# EAGLE schematic Eddy Backplane (EAGLE 9.5.2)

## Sheet 1 of 3: Back Plane
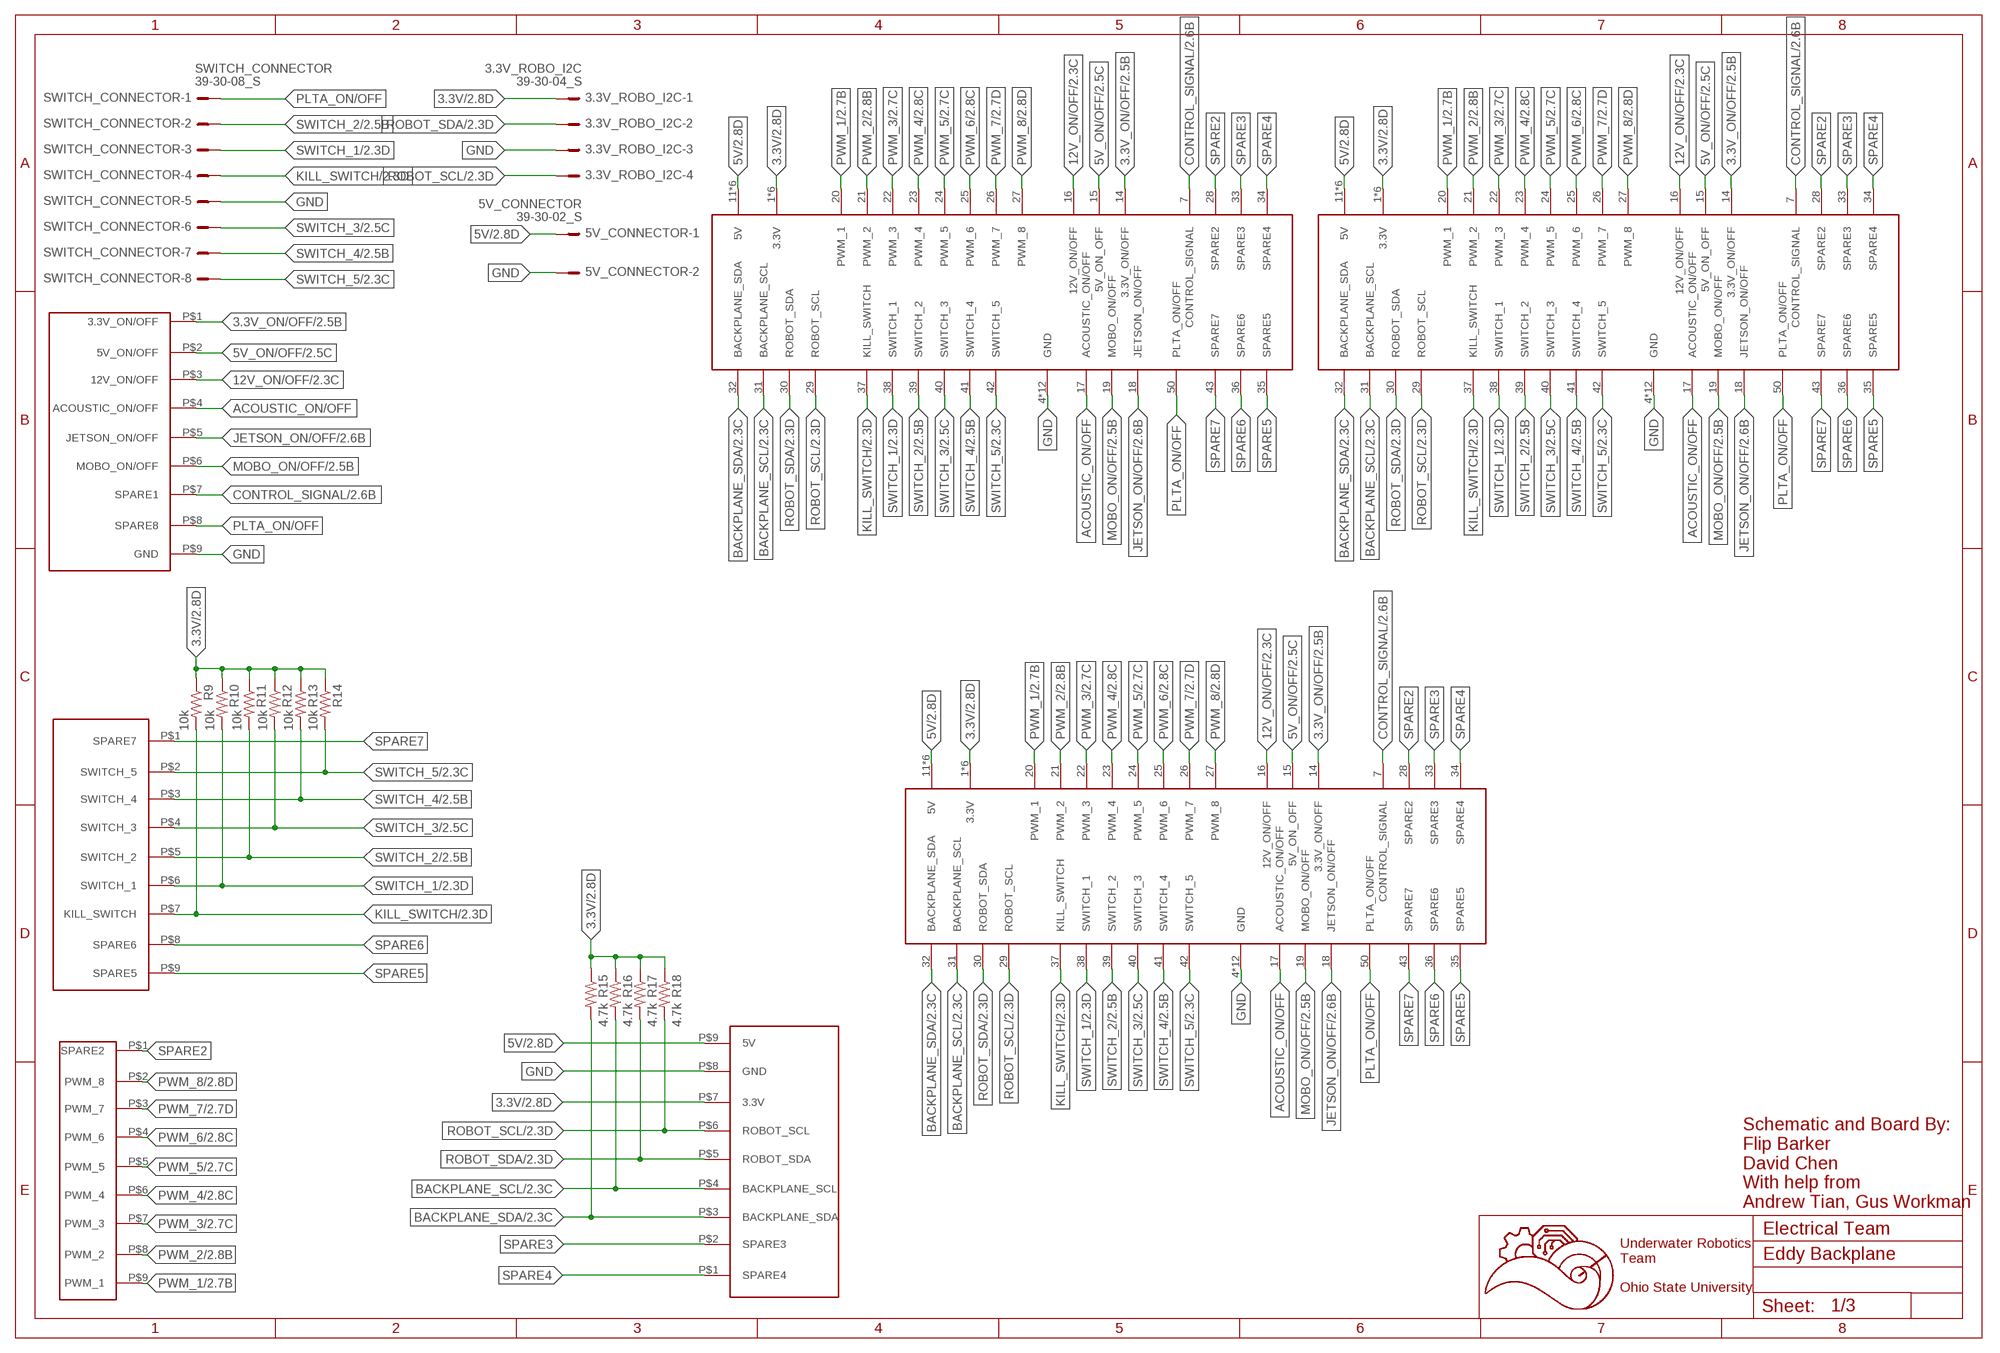
[diagram p0: schematic, sheet 1]

### Parts
3.3V_ROBO_I2C  39-30-04_S  [39-30-?04?]
5V_CONNECTOR  39-30-02_S  [39-30-?02?]
PWR_ON  929870-01-09_3  [929852-01-09_1ROW]
R9  10k  R-US_R0603  [R0603]
R10  10k  R-US_R0603  [R0603]
R11  10k  R-US_R0603  [R0603]
R12  10k  R-US_R0603  [R0603]
R13  10k  R-US_R0603  [R0603]
R14  10k  R-US_R0603  [R0603]
R15  4.7k  R-US_R0603  [R0603]
R16  4.7k  R-US_R0603  [R0603]
R17  4.7k  R-US_R0603  [R0603]
R18  4.7k  R-US_R0603  [R0603]
SWITCH_CONN  929870-01-09_1  [929852-01-09_1ROW]
SWITCH_CONNECTOR  39-30-08_S  [39-30-?08?]
U$1  5530843-FEMALE  [5530843-6-BACKPLANEMATE]
U$2  5530843-FEMALE  [5530843-6-BACKPLANEMATE]
U$3  5530843-FEMALE  [5530843-6-BACKPLANEMATE]
U$6  929870-01-09_2  [929852-01-09_1ROW]
U$8  929870-01-09_4  [929852-01-09_1ROW]

### Nets
3.3V: 3.3V_ROBO_I2C.1 R9.1 R10.1 R11.1 R12.1 R13.1 R14.1 R15.1 R16.1 R17.1 R18.1 U$1.1(3.3V) U$1.2(3.3V) U$1.3(3.3V) U$1.54(3.3V) U$1.55(3.3V) U$1.56(3.3V) U$2.1(3.3V) U$2.2(3.3V) U$2.3(3.3V) U$2.54(3.3V) U$2.55(3.3V) U$2.56(3.3V) U$3.1(3.3V) U$3.2(3.3V) U$3.3(3.3V) U$3.54(3.3V) U$3.55(3.3V) U$3.56(3.3V) U$8.P$7(3.3V) ; also sheet 2,3
3.3V_ON/OFF: PWR_ON.P$1(3.3V_ON/OFF) U$1.14(3.3V_ON/OFF) U$2.14(3.3V_ON/OFF) U$3.14(3.3V_ON/OFF) ; also sheet 2
5V: 5V_CONNECTOR.1 U$1.11(5V) U$1.12(5V) U$1.13(5V) U$1.44(5V) U$1.45(5V) U$1.46(5V) U$2.11(5V) U$2.12(5V) U$2.13(5V) U$2.44(5V) U$2.45(5V) U$2.46(5V) U$3.11(5V) U$3.12(5V) U$3.13(5V) U$3.44(5V) U$3.45(5V) U$3.46(5V) U$8.P$9(5V) ; also sheet 2
5V_ON/OFF: PWR_ON.P$2(5V_ON/OFF) U$1.15(5V_ON_OFF) U$2.15(5V_ON_OFF) U$3.15(5V_ON_OFF) ; also sheet 2
12V_ON/OFF: PWR_ON.P$3(12V_ON/OFF) U$1.16(12V_ON/OFF) U$2.16(12V_ON/OFF) U$3.16(12V_ON/OFF) ; also sheet 2
ACOUSTIC_ON/OFF: PWR_ON.P$4(ACOUSTIC_ON/OFF) U$1.17(ACOUSTIC_ON/OFF) U$2.17(ACOUSTIC_ON/OFF) U$3.17(ACOUSTIC_ON/OFF)
BACKPLANE_SCL: R16.2 U$1.31(BACKPLANE_SCL) U$2.31(BACKPLANE_SCL) U$3.31(BACKPLANE_SCL) U$8.P$4(BACKPLANE_SCL) ; also sheet 2
BACKPLANE_SDA: R15.2 U$1.32(BACKPLANE_SDA) U$2.32(BACKPLANE_SDA) U$3.32(BACKPLANE_SDA) U$8.P$3(BACKPLANE_SDA) ; also sheet 2
CONTROL_SIGNAL: PWR_ON.P$7(SPARE1) U$1.7(CONTROL_SIGNAL) U$2.7(CONTROL_SIGNAL) U$3.7(CONTROL_SIGNAL) ; also sheet 2
GND: 3.3V_ROBO_I2C.3 5V_CONNECTOR.2 PWR_ON.P$9(GND) SWITCH_CONNECTOR.5 U$1.4(GND) U$1.5(GND) U$1.6(GND) U$1.8(GND) U$1.9(GND) U$1.10(GND) U$1.47(GND) U$1.48(GND) U$1.49(GND) U$1.51(GND) U$1.52(GND) U$1.53(GND) U$2.4(GND) U$2.5(GND) U$2.6(GND) U$2.8(GND) U$2.9(GND) U$2.10(GND) U$2.47(GND) U$2.48(GND) U$2.49(GND) U$2.51(GND) U$2.52(GND) U$2.53(GND) U$3.4(GND) U$3.5(GND) U$3.6(GND) U$3.8(GND) U$3.9(GND) U$3.10(GND) U$3.47(GND) U$3.48(GND) U$3.49(GND) U$3.51(GND) U$3.52(GND) U$3.53(GND) U$8.P$8(GND) ; also sheet 2,3
JETSON_ON/OFF: PWR_ON.P$5(JETSON_ON/OFF) U$1.18(JETSON_ON/OFF) U$2.18(JETSON_ON/OFF) U$3.18(JETSON_ON/OFF) ; also sheet 2
KILL_SWITCH: R9.2 SWITCH_CONN.P$7(KILL_SWITCH) SWITCH_CONNECTOR.4 U$1.37(KILL_SWITCH) U$2.37(KILL_SWITCH) U$3.37(KILL_SWITCH) ; also sheet 2
MOBO_ON/OFF: PWR_ON.P$6(MOBO_ON/OFF) U$1.19(MOBO_ON/OFF) U$2.19(MOBO_ON/OFF) U$3.19(MOBO_ON/OFF) ; also sheet 2
PLTA_ON/OFF: PWR_ON.P$8(SPARE8) SWITCH_CONNECTOR.1 U$1.50(PLTA_ON/OFF) U$2.50(PLTA_ON/OFF) U$3.50(PLTA_ON/OFF)
PWM_1: U$1.20(PWM_1) U$2.20(PWM_1) U$3.20(PWM_1) U$6.P$9(PWM_1) ; also sheet 2
PWM_2: U$1.21(PWM_2) U$2.21(PWM_2) U$3.21(PWM_2) U$6.P$8(PWM_2) ; also sheet 2
PWM_3: U$1.22(PWM_3) U$2.22(PWM_3) U$3.22(PWM_3) U$6.P$7(PWM_3) ; also sheet 2
PWM_4: U$1.23(PWM_4) U$2.23(PWM_4) U$3.23(PWM_4) U$6.P$6(PWM_4) ; also sheet 2
PWM_5: U$1.24(PWM_5) U$2.24(PWM_5) U$3.24(PWM_5) U$6.P$5(PWM_5) ; also sheet 2
PWM_6: U$1.25(PWM_6) U$2.25(PWM_6) U$3.25(PWM_6) U$6.P$4(PWM_6) ; also sheet 2
PWM_7: U$1.26(PWM_7) U$2.26(PWM_7) U$3.26(PWM_7) U$6.P$3(PWM_7) ; also sheet 2
PWM_8: U$1.27(PWM_8) U$2.27(PWM_8) U$3.27(PWM_8) U$6.P$2(PWM_8) ; also sheet 2
ROBOT_SCL: 3.3V_ROBO_I2C.4 R18.2 U$1.29(ROBOT_SCL) U$2.29(ROBOT_SCL) U$3.29(ROBOT_SCL) U$8.P$6(ROBOT_SCL) ; also sheet 2
ROBOT_SDA: 3.3V_ROBO_I2C.2 R17.2 U$1.30(ROBOT_SDA) U$2.30(ROBOT_SDA) U$3.30(ROBOT_SDA) U$8.P$5(ROBOT_SDA) ; also sheet 2
SPARE2: U$1.28(SPARE2) U$2.28(SPARE2) U$3.28(SPARE2) U$6.P$1(SPARE2)
SPARE3: U$1.33(SPARE3) U$2.33(SPARE3) U$3.33(SPARE3) U$8.P$2(SPARE3)
SPARE4: U$1.34(SPARE4) U$2.34(SPARE4) U$3.34(SPARE4) U$8.P$1(SPARE4)
SPARE5: SWITCH_CONN.P$9(SPARE5) U$1.35(SPARE5) U$2.35(SPARE5) U$3.35(SPARE5)
SPARE6: SWITCH_CONN.P$8(SPARE6) U$1.36(SPARE6) U$2.36(SPARE6) U$3.36(SPARE6)
SPARE7: SWITCH_CONN.P$1(SPARE7) U$1.43(SPARE7) U$2.43(SPARE7) U$3.43(SPARE7)
SWITCH_1: R10.2 SWITCH_CONN.P$6(SWITCH_1) SWITCH_CONNECTOR.3 U$1.38(SWITCH_1) U$2.38(SWITCH_1) U$3.38(SWITCH_1) ; also sheet 2
SWITCH_2: R11.2 SWITCH_CONN.P$5(SWITCH_2) SWITCH_CONNECTOR.2 U$1.39(SWITCH_2) U$2.39(SWITCH_2) U$3.39(SWITCH_2) ; also sheet 2
SWITCH_3: R12.2 SWITCH_CONN.P$4(SWITCH_3) SWITCH_CONNECTOR.6 U$1.40(SWITCH_3) U$2.40(SWITCH_3) U$3.40(SWITCH_3) ; also sheet 2
SWITCH_4: R13.2 SWITCH_CONN.P$3(SWITCH_4) SWITCH_CONNECTOR.7 U$1.41(SWITCH_4) U$2.41(SWITCH_4) U$3.41(SWITCH_4) ; also sheet 2
SWITCH_5: R14.2 SWITCH_CONN.P$2(SWITCH_5) SWITCH_CONNECTOR.8 U$1.42(SWITCH_5) U$2.42(SWITCH_5) U$3.42(SWITCH_5) ; also sheet 2

### Notes on the sheet
- Schematic and Board By:
  Flip Barker
  David Chen
  With help from 
  Andrew Tian, Gus Workman
- Electrical Team
- Underwater Robotics
  Team
  
  Ohio State University

## Sheet 2 of 3: Microcontroller
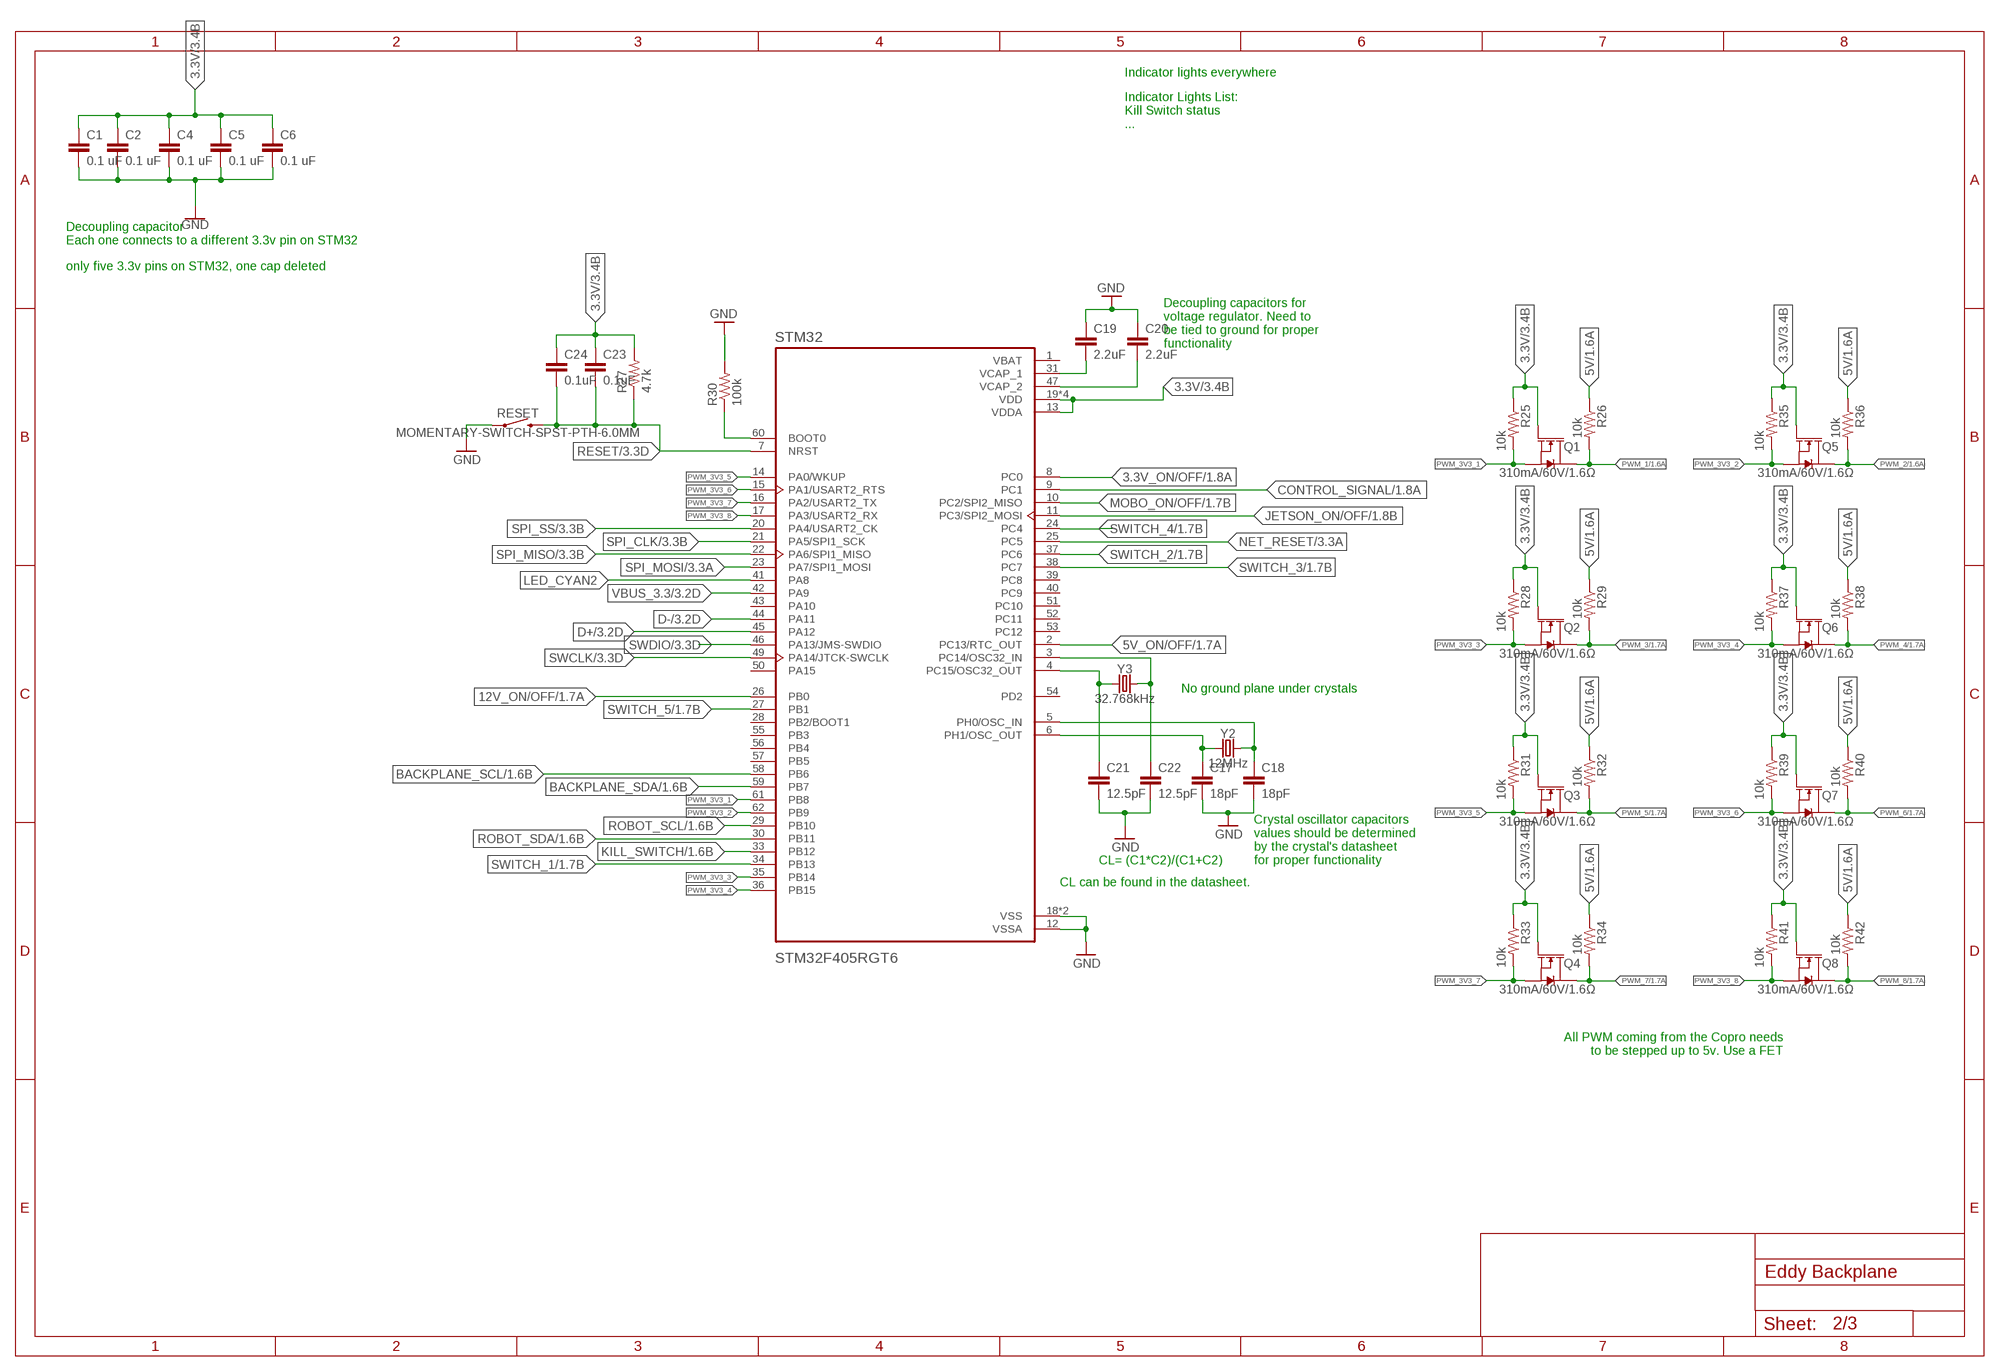
[diagram p1: schematic, sheet 2]

### Parts
C1  0.1 uF  C-EUC0603  [C0603]
C2  0.1 uF  C-EUC0603  [C0603]
C4  0.1 uF  C-EUC0603  [C0603]
C5  0.1 uF  C-EUC0603  [C0603]
C6  0.1 uF  C-EUC0603  [C0603]
C17  18pF  C-EUC0603  [C0603]
C18  18pF  C-EUC0603  [C0603]
C19  2.2uF  C-EUC0603  [C0603]
C20  2.2uF  C-EUC0603  [C0603]
C21  12.5pF  C-EUC0603  [C0603]
C22  12.5pF  C-EUC0603  [C0603]
C23  0.1uF  C-EUC0603  [C0603]
C24  0.1uF  C-EUC0603  [C0603]
Q1  310mA/60V/1.6Ω  MOSFET-NCH-2N7002PW  [SOT323]
Q2  310mA/60V/1.6Ω  MOSFET-NCH-2N7002PW  [SOT323]
Q3  310mA/60V/1.6Ω  MOSFET-NCH-2N7002PW  [SOT323]
Q4  310mA/60V/1.6Ω  MOSFET-NCH-2N7002PW  [SOT323]
Q5  310mA/60V/1.6Ω  MOSFET-NCH-2N7002PW  [SOT323]
Q6  310mA/60V/1.6Ω  MOSFET-NCH-2N7002PW  [SOT323]
Q7  310mA/60V/1.6Ω  MOSFET-NCH-2N7002PW  [SOT323]
Q8  310mA/60V/1.6Ω  MOSFET-NCH-2N7002PW  [SOT323]
R25  10k  R-US_R0603  [R0603]
R26  10k  R-US_R0603  [R0603]
R27  4.7k  R-US_R0603  [R0603]
R28  10k  R-US_R0603  [R0603]
R29  10k  R-US_R0603  [R0603]
R30  100k  R-US_R0603  [R0603]
R31  10k  R-US_R0603  [R0603]
R32  10k  R-US_R0603  [R0603]
R33  10k  R-US_R0603  [R0603]
R34  10k  R-US_R0603  [R0603]
R35  10k  R-US_R0603  [R0603]
R36  10k  R-US_R0603  [R0603]
R37  10k  R-US_R0603  [R0603]
R38  10k  R-US_R0603  [R0603]
R39  10k  R-US_R0603  [R0603]
R40  10k  R-US_R0603  [R0603]
R41  10k  R-US_R0603  [R0603]
R42  10k  R-US_R0603  [R0603]
RESET  MOMENTARY-SWITCH-SPST-PTH-6.0MM  [TACTILE_SWITCH_PTH_6.0MM]
STM32  STM32F405RGT6  [QFP50P1200X1200X160-64N]
Y2  12MHz  CRYSTAL-16MHZPTH-HC49US  [HC49US]
Y3  32.768kHz  CRYSTAL-32.768KHZSMD-3.2X1.5  [CRYSTAL-SMD-3.2X1.5MM]

### Nets
3.3V: C1.1 C2.1 C4.1 C5.1 C6.1 C23.1 C24.1 Q1.1(G) Q2.1(G) Q3.1(G) Q4.1(G) Q5.1(G) Q6.1(G) Q7.1(G) Q8.1(G) R25.1 R27.2 R28.1 R31.1 R33.1 R35.1 R37.1 R39.1 R41.1 STM32.13(VDDA) STM32.19(VDD) STM32.32(VDD) STM32.48(VDD) STM32.64(VDD) ; also sheet 1,3
3.3V_ON/OFF: STM32.8(PC0) ; also sheet 1
5V: R26.1 R29.1 R32.1 R34.1 R36.1 R38.1 R40.1 R42.1 ; also sheet 1
5V_ON/OFF: STM32.2(PC13/RTC_OUT) ; also sheet 1
12V_ON/OFF: STM32.26(PB0) ; also sheet 1
BACKPLANE_SCL: STM32.58(PB6) ; also sheet 1
BACKPLANE_SDA: STM32.59(PB7) ; also sheet 1
CONTROL_SIGNAL: STM32.9(PC1) ; also sheet 1
D+: STM32.45(PA12) ; also sheet 3
D-: STM32.44(PA11) ; also sheet 3
GND: C1.2 C2.2 C4.2 C5.2 C6.2 C17.2 C18.2 C19.1 C20.1 C21.2 C22.2 R30.2 RESET.1 STM32.12(VSSA) STM32.18(VSS) STM32.63(VSS) ; also sheet 1,3
JETSON_ON/OFF: STM32.11(PC3/SPI2_MOSI) ; also sheet 1
KILL_SWITCH: STM32.33(PB12) ; also sheet 1
LED_CYAN2: STM32.41(PA8)
MOBO_ON/OFF: STM32.10(PC2/SPI2_MISO) ; also sheet 1
N$17: C17.1 STM32.6(PH1/OSC_OUT) Y2.1
N$18: C18.1 STM32.5(PH0/OSC_IN) Y2.2
N$19: C20.2 STM32.47(VCAP_2)
N$20: C19.2 STM32.31(VCAP_1)
N$21: C21.1 STM32.4(PC15/OSC32_OUT) Y3.P$1
N$29: C22.1 STM32.3(PC14/OSC32_IN) Y3.P$2
N$30: R30.1 STM32.60(BOOT0)
NET_RESET: STM32.25(PC5) ; also sheet 3
PWM_1: Q1.3(D) R26.2 ; also sheet 1
PWM_2: Q5.3(D) R36.2 ; also sheet 1
PWM_3: Q2.3(D) R29.2 ; also sheet 1
PWM_3V3_1: Q1.2(S) R25.2 STM32.61(PB8)
PWM_3V3_2: Q5.2(S) R35.2 STM32.62(PB9)
PWM_3V3_3: Q2.2(S) R28.2 STM32.35(PB14)
PWM_3V3_4: Q6.2(S) R37.2 STM32.36(PB15)
PWM_3V3_5: Q3.2(S) R31.2 STM32.14(PA0/WKUP)
PWM_3V3_6: Q7.2(S) R39.2 STM32.15(PA1/USART2_RTS)
PWM_3V3_7: Q4.2(S) R33.2 STM32.16(PA2/USART2_TX)
PWM_3V3_8: Q8.2(S) R41.2 STM32.17(PA3/USART2_RX)
PWM_4: Q6.3(D) R38.2 ; also sheet 1
PWM_5: Q3.3(D) R32.2 ; also sheet 1
PWM_6: Q7.3(D) R40.2 ; also sheet 1
PWM_7: Q4.3(D) R34.2 ; also sheet 1
PWM_8: Q8.3(D) R42.2 ; also sheet 1
RESET: C23.2 C24.2 R27.1 RESET.3 STM32.7(NRST) ; also sheet 3
ROBOT_SCL: STM32.29(PB10) ; also sheet 1
ROBOT_SDA: STM32.30(PB11) ; also sheet 1
SPI_CLK: STM32.21(PA5/SPI1_SCK) ; also sheet 3
SPI_MISO: STM32.22(PA6/SPI1_MISO) ; also sheet 3
SPI_MOSI: STM32.23(PA7/SPI1_MOSI) ; also sheet 3
SPI_SS: STM32.20(PA4/USART2_CK) ; also sheet 3
SWCLK: STM32.49(PA14/JTCK-SWCLK) ; also sheet 3
SWDIO: STM32.46(PA13/JMS-SWDIO) ; also sheet 3
SWITCH_1: STM32.34(PB13) ; also sheet 1
SWITCH_2: STM32.37(PC6) ; also sheet 1
SWITCH_3: STM32.38(PC7) ; also sheet 1
SWITCH_4: STM32.24(PC4) ; also sheet 1
SWITCH_5: STM32.27(PB1) ; also sheet 1
VBUS_3.3: STM32.42(PA9) ; also sheet 3
Unconnected: STM32.28(PB2/BOOT1) STM32.39(PC8) STM32.40(PC9) STM32.43(PA10) STM32.50(PA15) STM32.51(PC10) STM32.52(PC11) STM32.53(PC12) STM32.54(PD2) STM32.55(PB3) STM32.56(PB4) STM32.57(PB5)

### Notes on the sheet
- Indicator lights everywhere
- Indicator Lights List:
  Kill Switch status
  ...
- Decoupling capacitor
  Each one connects to a different 3.3v pin on STM32
- only five 3.3v pins on STM32, one cap deleted
- Decoupling capacitors for 
  voltage regulator. Need to
  be tied to ground for proper
  functionality
- No ground plane under crystals
- CL= (C1*C2)/(C1+C2)
- Crystal oscillator capacitors
  values should be determined
  by the crystal's datasheet
  for proper functionality
- CL can be found in the datasheet.
- All PWM coming from the Copro needs
  to be stepped up to 5v. Use a FET

## Sheet 3 of 3: Connectors
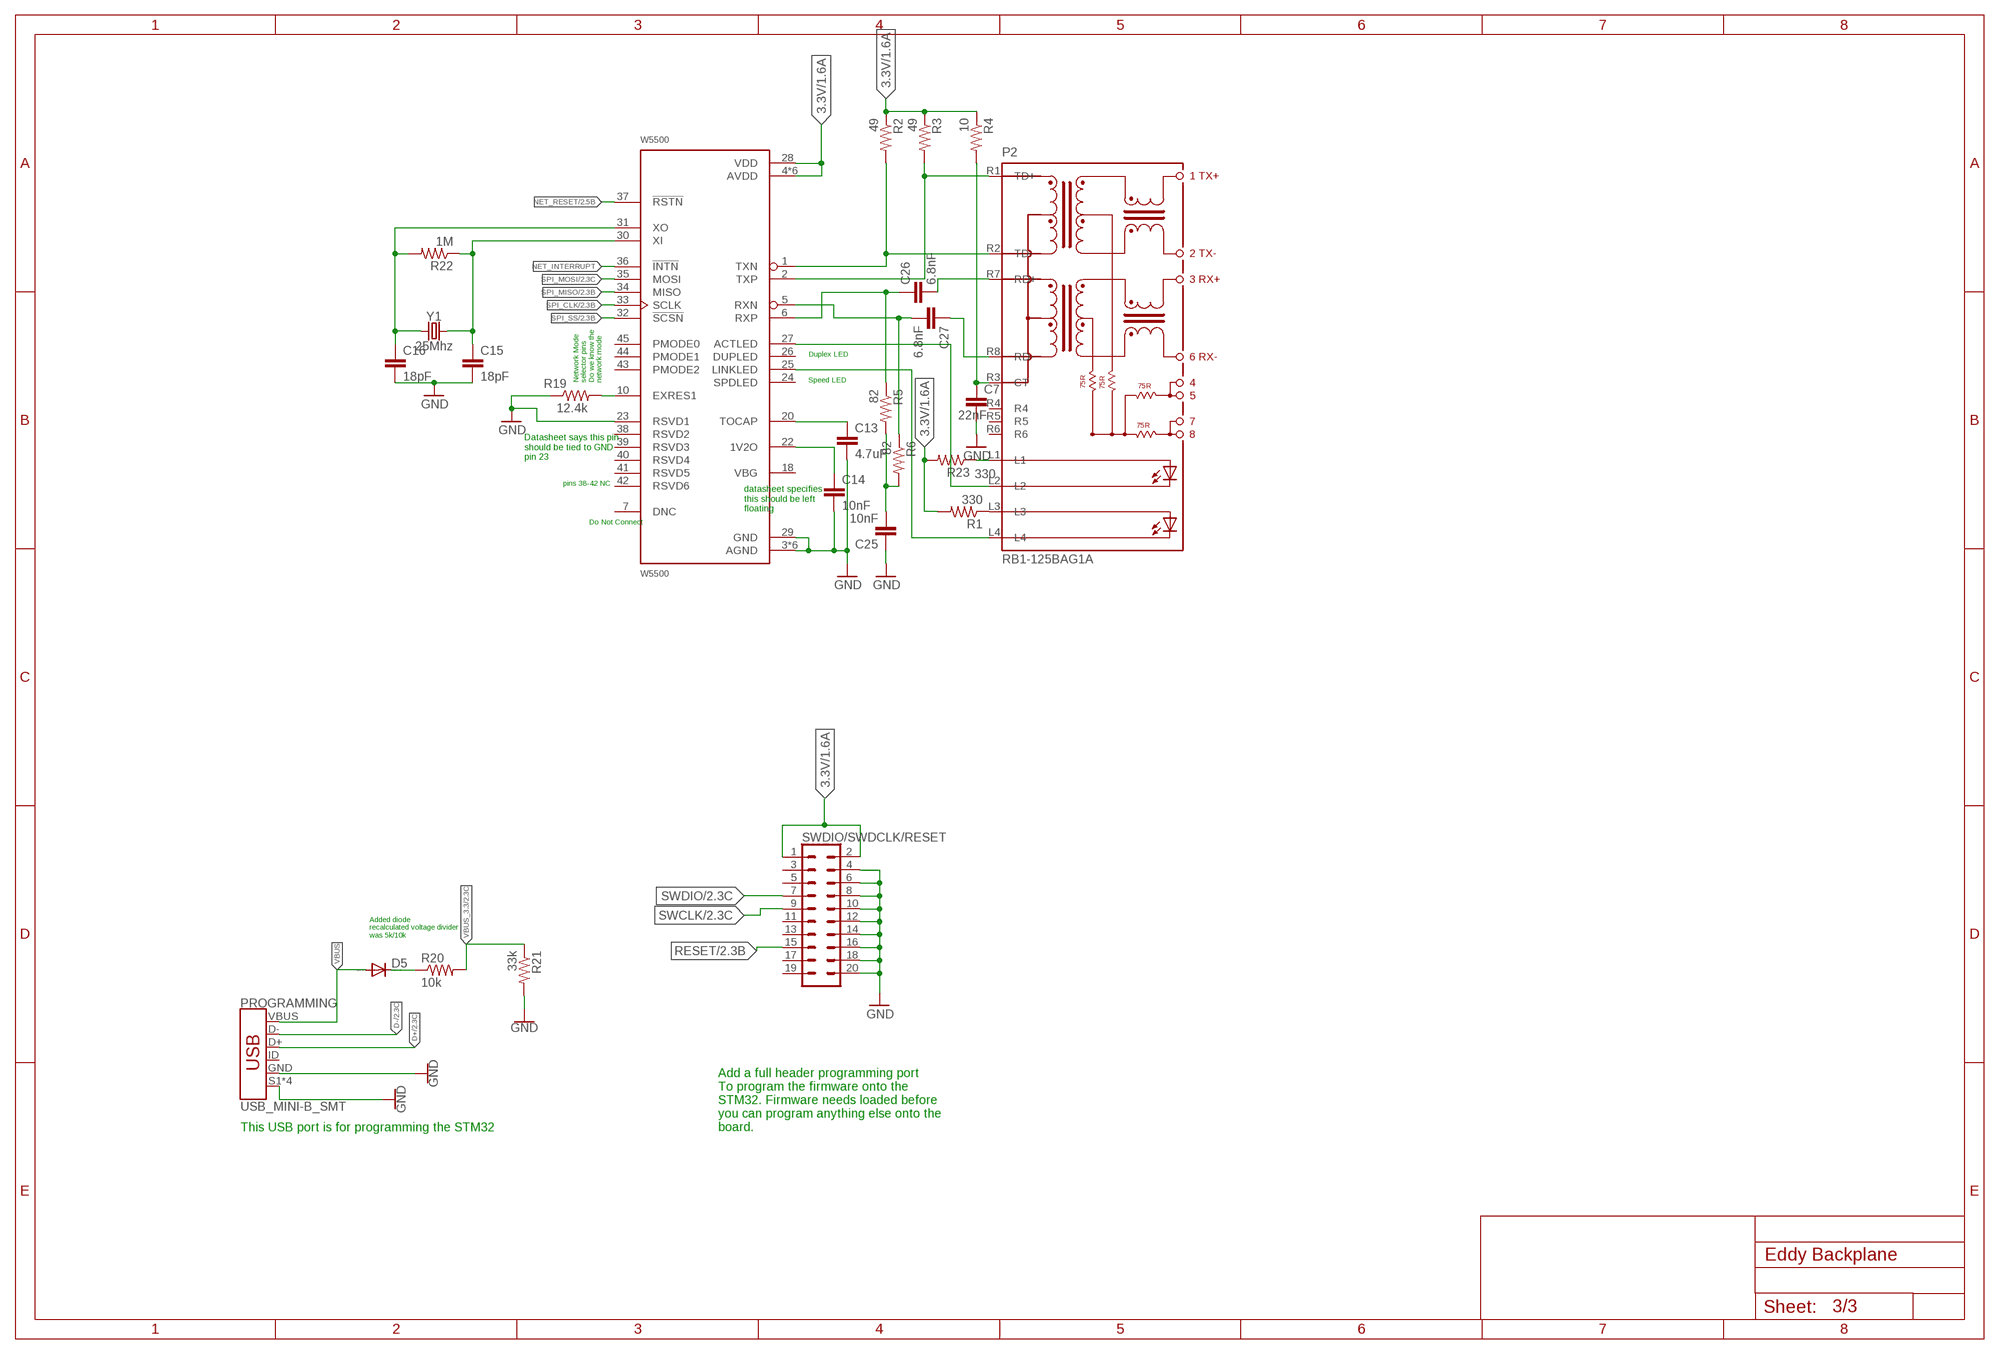
[diagram p2: schematic, sheet 3]

### Parts
C7  22nF  C-EUC0603  [C0603]
C13  4.7uF  C-EUC0603  [C0603]
C14  10nF  C-EUC0603  [C0603]
C15  18pF  C-EUC0603  [C0603]
C16  18pF  C-EUC0603  [C0603]
C25  10nF  C-EUC0603  [C0603]
C26  6.8nF  C-EUC0603  [C0603]
C27  6.8nF  C-EUC0603  [C0603]
D5  DIODE-SMB  [SMB]
P2  RB1-125BAG1A  [WIZNET_RB1-125BAG1A]
PROGRAMMING  USB_MINI-B_SMT  [USB-MINIB]
R1  330  R-US_R0603  [R0603]
R2  49  R-US_R0603  [R0603]
R3  49  R-US_R0603  [R0603]
R4  10  R-US_R0603  [R0603]
R5  82  R-US_R0603  [R0603]
R6  82  R-US_R0603  [R0603]
R19  12.4k  R-US_R0603  [R0603]
R20  10k  R-US_R0603  [R0603]
R21  33k  R-US_R0603  [R0603]
R22  1M  R-US_R0603  [R0603]
R23  330  R-US_R0603  [R0603]
SWDIO/SWDCLK/RESET  CONN_10X2  [2X10]
W5500  W5500  [QFP50P900X900X160-48N]
Y1  25Mhz  CRYSTALPTH-HC49US  [HC49US]

### Nets
3.3V: R1.2 R2.1 R3.1 R4.1 R23.2 SWDIO/SWDCLK/RESET.1 SWDIO/SWDCLK/RESET.2 W5500.4(AVDD) W5500.8(AVDD) W5500.11(AVDD) W5500.15(AVDD) W5500.17(AVDD) W5500.21(AVDD) W5500.28(VDD) ; also sheet 1,2
D+: PROGRAMMING.D+ ; also sheet 2
D-: PROGRAMMING.D- ; also sheet 2
GND: C7.2 C13.2 C14.2 C15.2 C16.2 C25.1 PROGRAMMING.GND PROGRAMMING.S1(SHIELD) PROGRAMMING.S2(SHIELD) PROGRAMMING.S3(SHIELD) PROGRAMMING.S4(SHIELD) R19.1 R21.2 SWDIO/SWDCLK/RESET.4 SWDIO/SWDCLK/RESET.6 SWDIO/SWDCLK/RESET.8 SWDIO/SWDCLK/RESET.10 SWDIO/SWDCLK/RESET.12 SWDIO/SWDCLK/RESET.14 SWDIO/SWDCLK/RESET.16 SWDIO/SWDCLK/RESET.18 SWDIO/SWDCLK/RESET.20 W5500.3(AGND) W5500.9(AGND) W5500.14(AGND) W5500.16(AGND) W5500.19(AGND) W5500.23(RSVD1) W5500.29(GND) W5500.48(AGND) ; also sheet 1,2
N$1: C7.1 P2.R3(CT) R4.2
N$4: C14.1 W5500.22(1V2O)
N$8: D5.C R20.1
N$9: C15.1 R22.1 W5500.30(XI) Y1.2
N$10: C16.1 R22.2 W5500.31(XO) Y1.1
N$11: P2.L4 W5500.25(LINKLED)
N$12: P2.L2 W5500.27(ACTLED)
N$13: C13.1 W5500.20(TOCAP)
N$14: R19.2 W5500.10(EXRES1)
N$15: P2.L1 R23.1
N$16: P2.L3 R1.1
N$22: C25.2 R5.2 R6.2
N$23: P2.R1(TD+) R3.2 W5500.2(TXP)
N$24: P2.R2(TD-) R2.2 W5500.1(TXN)
N$25: C26.2 P2.R7(RD+)
N$26: C26.1 R5.1 W5500.6(RXP)
N$27: C27.2 R6.1 W5500.5(RXN)
N$28: C27.1 P2.R8(RD-)
NET_INTERRUPT: W5500.36(!INTN)
NET_RESET: W5500.37(!RSTN) ; also sheet 2
RESET: SWDIO/SWDCLK/RESET.15 ; also sheet 2
SPI_CLK: W5500.33(SCLK) ; also sheet 2
SPI_MISO: W5500.34(MISO) ; also sheet 2
SPI_MOSI: W5500.35(MOSI) ; also sheet 2
SPI_SS: W5500.32(!SCSN) ; also sheet 2
SWCLK: SWDIO/SWDCLK/RESET.9 ; also sheet 2
SWDIO: SWDIO/SWDCLK/RESET.7 ; also sheet 2
VBUS: D5.A PROGRAMMING.VBUS
VBUS_3.3: R20.2 R21.1 ; also sheet 2
Unconnected: P2.R4 P2.R5 P2.R6 PROGRAMMING.ID SWDIO/SWDCLK/RESET.3 SWDIO/SWDCLK/RESET.5 SWDIO/SWDCLK/RESET.11 SWDIO/SWDCLK/RESET.13 SWDIO/SWDCLK/RESET.17 SWDIO/SWDCLK/RESET.19 W5500.7(DNC) W5500.18(VBG) W5500.24(SPDLED) W5500.26(DUPLED) W5500.38(RSVD2) W5500.39(RSVD3) W5500.40(RSVD4) W5500.41(RSVD5) W5500.42(RSVD6) W5500.43(PMODE2) W5500.44(PMODE1) W5500.45(PMODE0)

### Notes on the sheet
- Duplex LED
- Network Mode
  selector pins
  Do we know the
  network mode
- Speed LED
- Datasheet says this pin
  should be tied to GND
  pin 23
- pins 38-42 NC
- datasheet specifies
  this should be left
  floating
- Do Not Connect
- Added diode
  recalculated voltage divider
  was 5k/10k
- This USB port is for programming the STM32
- Add a full header programming port
  To program the firmware onto the 
  STM32. Firmware needs loaded before
  you can program anything else onto the 
  board.

## Power pins joined to a net without a drawn wire
VBAT: STM32.1(VBAT)

## Library data of the parts
3.3V_ROBO_I2C = con-molex-mini-fit:39-30-?04?_S: HEADER
5V_CONNECTOR = con-molex-mini-fit:39-30-?02?_S: HEADER
C1 C2 C4-C7 C13-C27 = rcl:C-EU: CAPACITOR, European symbol; SPICEPREFIX: C
D5 = diode:DIODE-: DIODE
P2 = RJ45-MAGJACK:RB1-125BAG1A: Accessory RJ-45 With Transformer Connector - UDE; AVAILABILITY: Unavailable; DESCRIPTION: Accessory RJ-45 With Transformer Connector - UDE; MF: WIZnet; MP: RB1-125BAG1A; PACKAGE: HVQFN-36 NXP Semiconductors; PRICE: None
PROGRAMMING = SparkFun-Connectors:USB_MINI-B: USB type Mini-B Connector Breaks out 5th pin, and includes shield pins if needed. SparkFun Products: SparkFun FTDI Basic Breakout <https://www.sparkfun.com/products/9716> SparkFun XBee Explorer USB <https://www.sparkfun.com/products/11812> SparkFun Redboard <https://www.sparkfun.com/products/12757>; PROD_ID: CONN-08193; SF_ID: PRT-00587
PWR_ON = 3M_929852_Connector:929870-01-09_3
Q1-Q8 = SparkFun-DiscreteSemi:MOSFET-NCH: N-channel MOSFETs Voltage controlled devices that allow control of high current outputs. SparkFun Products: SparkFun OpenScale <https://www.sparkfun.com/products/13261> SparkFun Digital Sandbox <https://www.sparkfun.com/products/12651> SparkFun Monster Moto Shield <https://www.sparkfun.com/products/10182> SparkFun MOSFET Power Controller <https://www.sparkfun.com/products/11214>; PROD_ID: TRANS-11151
R1-R6 R9-R23 R25-R42 = rcl:R-US_: RESISTOR, American symbol; SPICEPREFIX: R
RESET = SparkFun-Switches:MOMENTARY-SWITCH-SPST: Momentary Switch (Pushbutton) - SPST Normally-open (NO) SPST momentary switches (buttons, pushbuttons). Variants PTH-12MM - 12mm square, through-hole Momentary Pushbutton Switch - 12mm Square <https://www.sparkfun.com/products/9190> (COM-09190) PTH-6.0MM, PTH-6.0MM-KIT - 6.0mm square, through-hole Mini Pushbutton Switch <https://www.sparkfun.com/products/97> (COM-00097) KIT package intended for soldering kit's - only one side of pads' copper is exposed. PTH-RIGHT-ANGLE-KIT - Right-angle, through-hole Right Angle Tactile Button <https://www.sparkfun.com/products/10791> - Used on SparkFun BigTime Watch Kit <https://www.sparkfun.com/products/11734> SMD-12MM - 12mm square, surface-mount Tactile Button - SMD (12mm) <https://www.sparkfun.com/products/12993> (COM-12993) Used on SparkFun PicoBoard <https://www.sparkfun.com/products/11888> SMD-4.5MM - 4.5mm Square Trackball Switch Used on SparkFun Blackberry Trackballer Breakout <https://www.sparkfun.com/products/13169> SMD-4.6MMX2.8MM - 4.60mm x 2.80mm, surface mount Used on SparkFun SAMD21 Mini Breakout <https://www.sparkfun.com/products/13664> SMD-5.2MM, SMD-5.2-REDUNDANT - 5.2mm square, surface-mount Mini Pushbutton Switch - SMD <https://www.sparkfun.com/products/8720> (COM-08720) Used on Arduino Pro Mini <https://www.sparkfun.com/products/11114> REDUNDANT package connects both switch circuits together SMD-6.0X3.5MM - 6.0 x 3.5mm, surface mount Momentary Reset Switch SMD <https://www.sparkfun.com/products/8229> (COM-08229) SMD-6.2MM-TALL - 6.2mm square, surface mount Tactile Button - SMD (6mm) <https://www.sparkfun.com/products/12992> Used on SparkFun Digital Sandbox <https://www.sparkfun.com/products/12651> SMD-RIGHT-ANGLE - Right-angle, surface mount Used on SparkFun Block for Intel® Edison - Arduino <https://www.sparkfun.com/products/13036>; PROD_ID: SWCH-08441; SF_SKU: COM-00097
STM32 = STM32F405RGT6:STM32F405RGT6: High-performance foundation line, ARM Cortex-M4 core with DSP and FPU, 1 Mbyte Flash, 168 MHz CPU, ART Accelerator; AVAILABILITY: Unavailable; DESCRIPTION: High-performance foundation line, ARM Cortex-M4 core with DSP and FPU, 1 Mbyte Flash, 168 MHz CPU, ART Accelerator; MF: STMicroelectronics; MP: STM32F405RGT6; PACKAGE: LQFP-64 STMicroelectronics; PRICE: None
SWDIO/SWDCLK/RESET = SparkFun-Connectors:CONN_10X2: Multi connection point. Often used as Generic Header-pin footprint for 0.1 inch spaced/style header connections On any of the 0.1 inch spaced packages, you can populate with these: Break Away Headers - Straight <https://www.sparkfun.com/products/116> (PRT-00116) Break Away Male Headers - Right Angle <https://www.sparkfun.com/products/553> (PRT-00553) Female Headers <https://www.sparkfun.com/products/115> (PRT-00115) Break Away Headers - Machine Pin <https://www.sparkfun.com/products/117> (PRT-00117) Break Away Female Headers - Swiss Machine Pin <https://www.sparkfun.com/products/743> (PRT-00743) Special note about the "SPECIAL" package: This was SPECIALLY designed to be used with our Graphic LCD Backpack. Be sure you want to use this! It is not only staggered on each line of header holes, but IT IS ALSO offset of the center point of the top and bottom lines by 5 mil. This causes the headers to lock into place on the "standard" footprint on the LCD screen. The extra squares on the tdocu layer are there simply to reference other pins (if you were to actually populate a longer header than ten long - this is what we do with the backpacks).
SWITCH_CONN = 3M_929852_Connector:929870-01-09_1
SWITCH_CONNECTOR = con-molex-mini-fit:39-30-?08?_S: HEADER
U$1-U$3 = 5530843-6:5530843-FEMALE
U$6 = 3M_929852_Connector:929870-01-09_2
U$8 = 3M_929852_Connector:929870-01-09_4
W5500 = W5500:W5500: Hardwired TCP/IP embedded Ethernet controller; AVAILABILITY: Unavailable; DESCRIPTION: Victor Pure White Collection Wood Tidy Tower Organizer; MF: WIZnet; MP: W5500; PACKAGE: LQFP-48 Victor Technologies; PRICE: None
Y1 = SparkFun-Clocks:CRYSTAL: Crystals (Generic) These are passive quartz crystals, which can be used as a clock source for a microcontroller. Crystal's are two-terminal devices. They require external "load" capacitors to generate an oscillating signal.
Y2 = SparkFun-Clocks:CRYSTAL-16MHZ: 16MHz Crystal Digikey Example <http://www.digikey.com/product-search/en?keywords=535-9122-1-ND> Frequency: 16MHz Frequency Stability: ±50ppm Frequency Tolerance: ±20ppm Load Capacitance: 18pF SparkFun Products: Pro Micro -5V/16MHz <https://www.sparkfun.com/products/12640> SparkFun Serial Enabled LCD Kit <https://www.sparkfun.com/products/10097>; PROD_ID: XTAL-08181; SF_ID: COM-00536; VALUE: 16MHz
Y3 = SparkFun-Clocks:CRYSTAL-32.768KHZ: 32.768kHz Crystal Frequency: 32.768kHz Frequency Stability: ±20ppm Load Capacitance: 12.5pF (PTH-2X6 & SMD-3.2X1.5), 6pF (SMD-2X6) SparkFun Products: SparkFun BigTime Watch Kit <https://www.sparkfun.com/products/11734> SparkFun nRF52832 Breakout <https://www.sparkfun.com/products/13990> SparkFun Real Time Clock Module <https://www.sparkfun.com/products/12708>; PROD_ID: XTAL-13062